# Altium schematic sheet STM32F103C6.SchDoc
size 209 x 297 mm; SheetNumber: 2; SheetTotal: 3
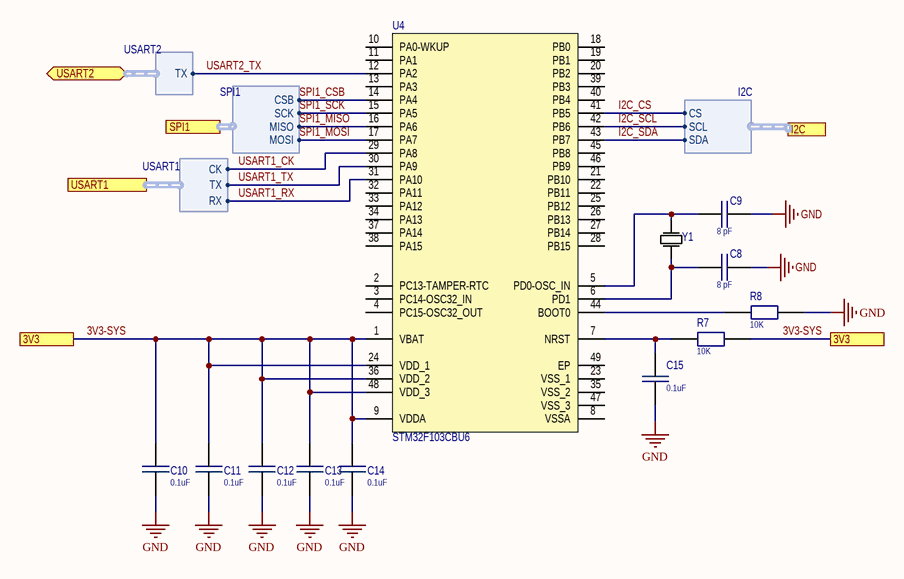
[diagram p0: STM32F103C6.SchDoc]

## Parts
C8  8 pF  [C_0805]
C9  8 pF  [C_0805]
C10  0.1uF  [C_0805]
C11  0.1uF  [C_0805]
C12  0.1uF  [C_0805]
C13  0.1uF  [C_0805]
C14  0.1uF  [C_0805]
C15  0.1uF  [C_0805]
R7  10K  [R_0402]
R8  10K  [R_0402]
U4  STM32F103CBU6  [STM-UFQFPN48_M]
Y1  (no value)  [NX3225GD]

## Ports
3V3, I2C (harness I2C), SPI1 (harness SPI1), USART1 (harness USART1), USART2 (bidir, harness USART2)

## Harnesses
SPI1: CSB, SCK, MISO, MOSI
USART1: CK, TX, RX
I2C: CS, SCL, SDA
USART2: TX

## Nets
GND: C8.2 C9.1 C10.2 C11.2 C12.2 C13.2 C14.2 C15.1 R8.2
3V3-SYS: C10.1 C11.1 C12.1 C13.1 C14.1 R7.2 U4.1(VBAT) U4.9(VDDA) U4.24(VDD_1) U4.36(VDD_2) U4.48(VDD_3) ; port 3V3
I2C_CS: U4.41(PB5) ; port I2C.CS
I2C_SCL: U4.42(PB6) ; port I2C.SCL
I2C_SDA: U4.43(PB7) ; port I2C.SDA
SPI1_CSB: U4.14(PA4) ; port SPI1.CSB
SPI1_MISO: U4.16(PA6) ; port SPI1.MISO
SPI1_MOSI: U4.17(PA7) ; port SPI1.MOSI
SPI1_SCK: U4.15(PA5) ; port SPI1.SCK
USART1_CK: U4.29(PA8) ; port USART1.CK
USART1_RX: U4.31(PA10) ; port USART1.RX
USART1_TX: U4.30(PA9) ; port USART1.TX
USART2_TX: U4.12(PA2) ; port USART2.TX
NetC8_1: C8.1 U4.6(PD1) Y1.1(OSC1)
NetC9_2: C9.2 U4.5(PD0-OSC_IN) Y1.2(OSC2)
NetC15_2: C15.2 R7.1 U4.7(NRST)
NetR8_1: R8.1 U4.44(BOOT0)

Not connected (* = marked no-connect by the designer): U4 2(PC13-TAMPER-RTC) 3(PC14-OSC32_IN) 4(PC15-OSC32_OUT) 8(VSSA) 10(PA0-WKUP) 11(PA1) 13(PA3) 18(PB0) 19(PB1) 20(PB2) 21(PB10) 22(PB11) 23(VSS_1) 25(PB12) 26(PB13) 27(PB14) 28(PB15) 32(PA11) 33(PA12) 34(PA13) 35(VSS_2) 37(PA14) 38(PA15) 39(PB3) 40(PB4) 45(PB8) 46(PB9) 47(VSS_3) 49(EP)

## Library data of the parts
C8-C15 = C0805: Capacitor
  C8 C9: Value: 8 pF
  C10-C15: Value: 0.1uF
R7 R8 = R0402: Resistor; Value: 10K
U4 = STM32F103CBU6: STM32 ARM-based 32-bit MCU Performance Line with 128 kB Flash, 20 kB Internal RAM, -40 to +85°C Temperature, 48-Pin VFQFPN, Tray; DatasheetVersion: rev13.0, Apr-2011; PackageVersion: 2011; PackageReference: VFQFPN48; PackageDescription: 48-Pin Quad Flat No-Lead, 7 x 7 x 0.9 mm Body, 0.5 mm Pitch, Exposed Pad; ComponentLink1Description: Manufacturer URL; ComponentLink1URL: http://www.st.com/; ComponentLink2Description: STM32F103 Datasheet; ComponentLink2URL: http://www.st.com/internet/com/TECHNICAL_RESOURCES/TECHNICAL_LITERATURE/DATASHEET/CD00161566.pdf; ComponentLink3Description: STM32 Family Web Page; ComponentLink3URL: www.st.com/stm32
Y1 = NX3225GD: Crystal Oscillator